# Altium schematic sheet Etapa_Potencia.schdoc
size 162 x 59 mm
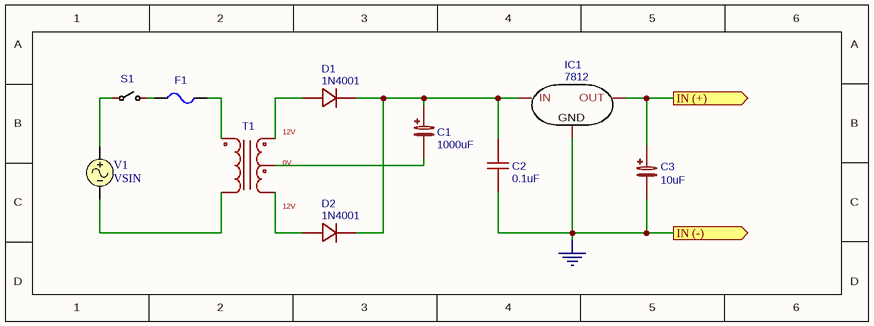
[diagram p0: Etapa_Potencia.schdoc]

## Parts
C1  1000uF  [CAP-D3.0XF1.5]
C2  0.1uF  [RAD-0.1]
C3  10uF  [CAP-D3.0XF1.5]
D1  1N4001  [DO35-10]
D2  1N4001  [DO35-10]
F1  FUSE  [FUSE3.15A]  (value not drawn)
IC1  7812  [TO92]
S1  DUAL_SWITCH_INV  [NONE]  (value not drawn)
T1  XFMR_TAP  [TRANSFORMER 2 TO 3]  (value not drawn)
V1  VSIN

## Ports
IN (+) (out), IN (-) (out)

## Nets
GND: C2.1 C3.2 IC1.2(GND) ; port IN (-)
IN (+): C3.1 IC1.1(OUT) ; port IN (+)
NetC1_1: C1.1 C2.2 D1.2(-) D2.2(-) IC1.3(IN)
NetC1_2: C1.2 T1.4
NetD1_1: D1.1(+) T1.5
NetD2_1: D2.1(+) T1.3
NetF1_1: F1.1(A) S1.1
NetF1_2: F1.2(A) T1.1
NetS1_2: S1.2 V1.1
NetT1_2: T1.2 V1.2

## Notes on the sheet
- (near T1) 0V
- (in symbol XFMR_TAP) 12V

## Library data of the parts
C1 = 1000uF: nameAlias: Value(F); BOM_Manufacturer Part: ?; spicePre: C; spiceSymbolName: Capacitor
C2 = 0.1uF: nameAlias: Value(F); BOM_Manufacturer Part: ?; spicePre: C; spiceSymbolName: Cap_RAD-0.1_US
C3 = 10uF: nameAlias: Value(F); BOM_Manufacturer Part: ?; spicePre: C; spiceSymbolName: Capacitor
IC1 = 7812: Contributor: Chayapol; BOM_Manufacturer Part: ?; spicePre: U
S1 = DUAL_SWITCH_INV: Contributor: KiCad; BOM_Manufacturer Part: ?; spicePre: S
T1 = XFMR_TAP: RATIO: 2; spicePre: X; BOM_Manufacturer Part: ?
V1 = VSIN: Sinusoidal Voltage Source; Note: PCB Footprint - Not required; Published: 8-Jun-2000; LatestRevisionDate: 15-Nov-2004; LatestRevisionNote: Corrected Netlist.; PackageReference: Not Applicable; Publisher: Altium Limited
D1 D2 = 1N4001: BOM_Manufacturer Part: ?; spicePre: D
F1 = FUSE: BOM_Manufacturer Part: ?; spicePre: F